# EasyEDA Pro project SBMS.eprj

# Schematic PowerSupply
Create Date: 2024-10-21; Page Name: P1; Project Name: SBMS; Schematic Name: PowerSupply; Update Date: 2024-10-21; Company: EasyEDA.com; Drawn: Edwin Mwiti; Page Size: A4; Part Number: JLCPCB-002; Version: V0.1
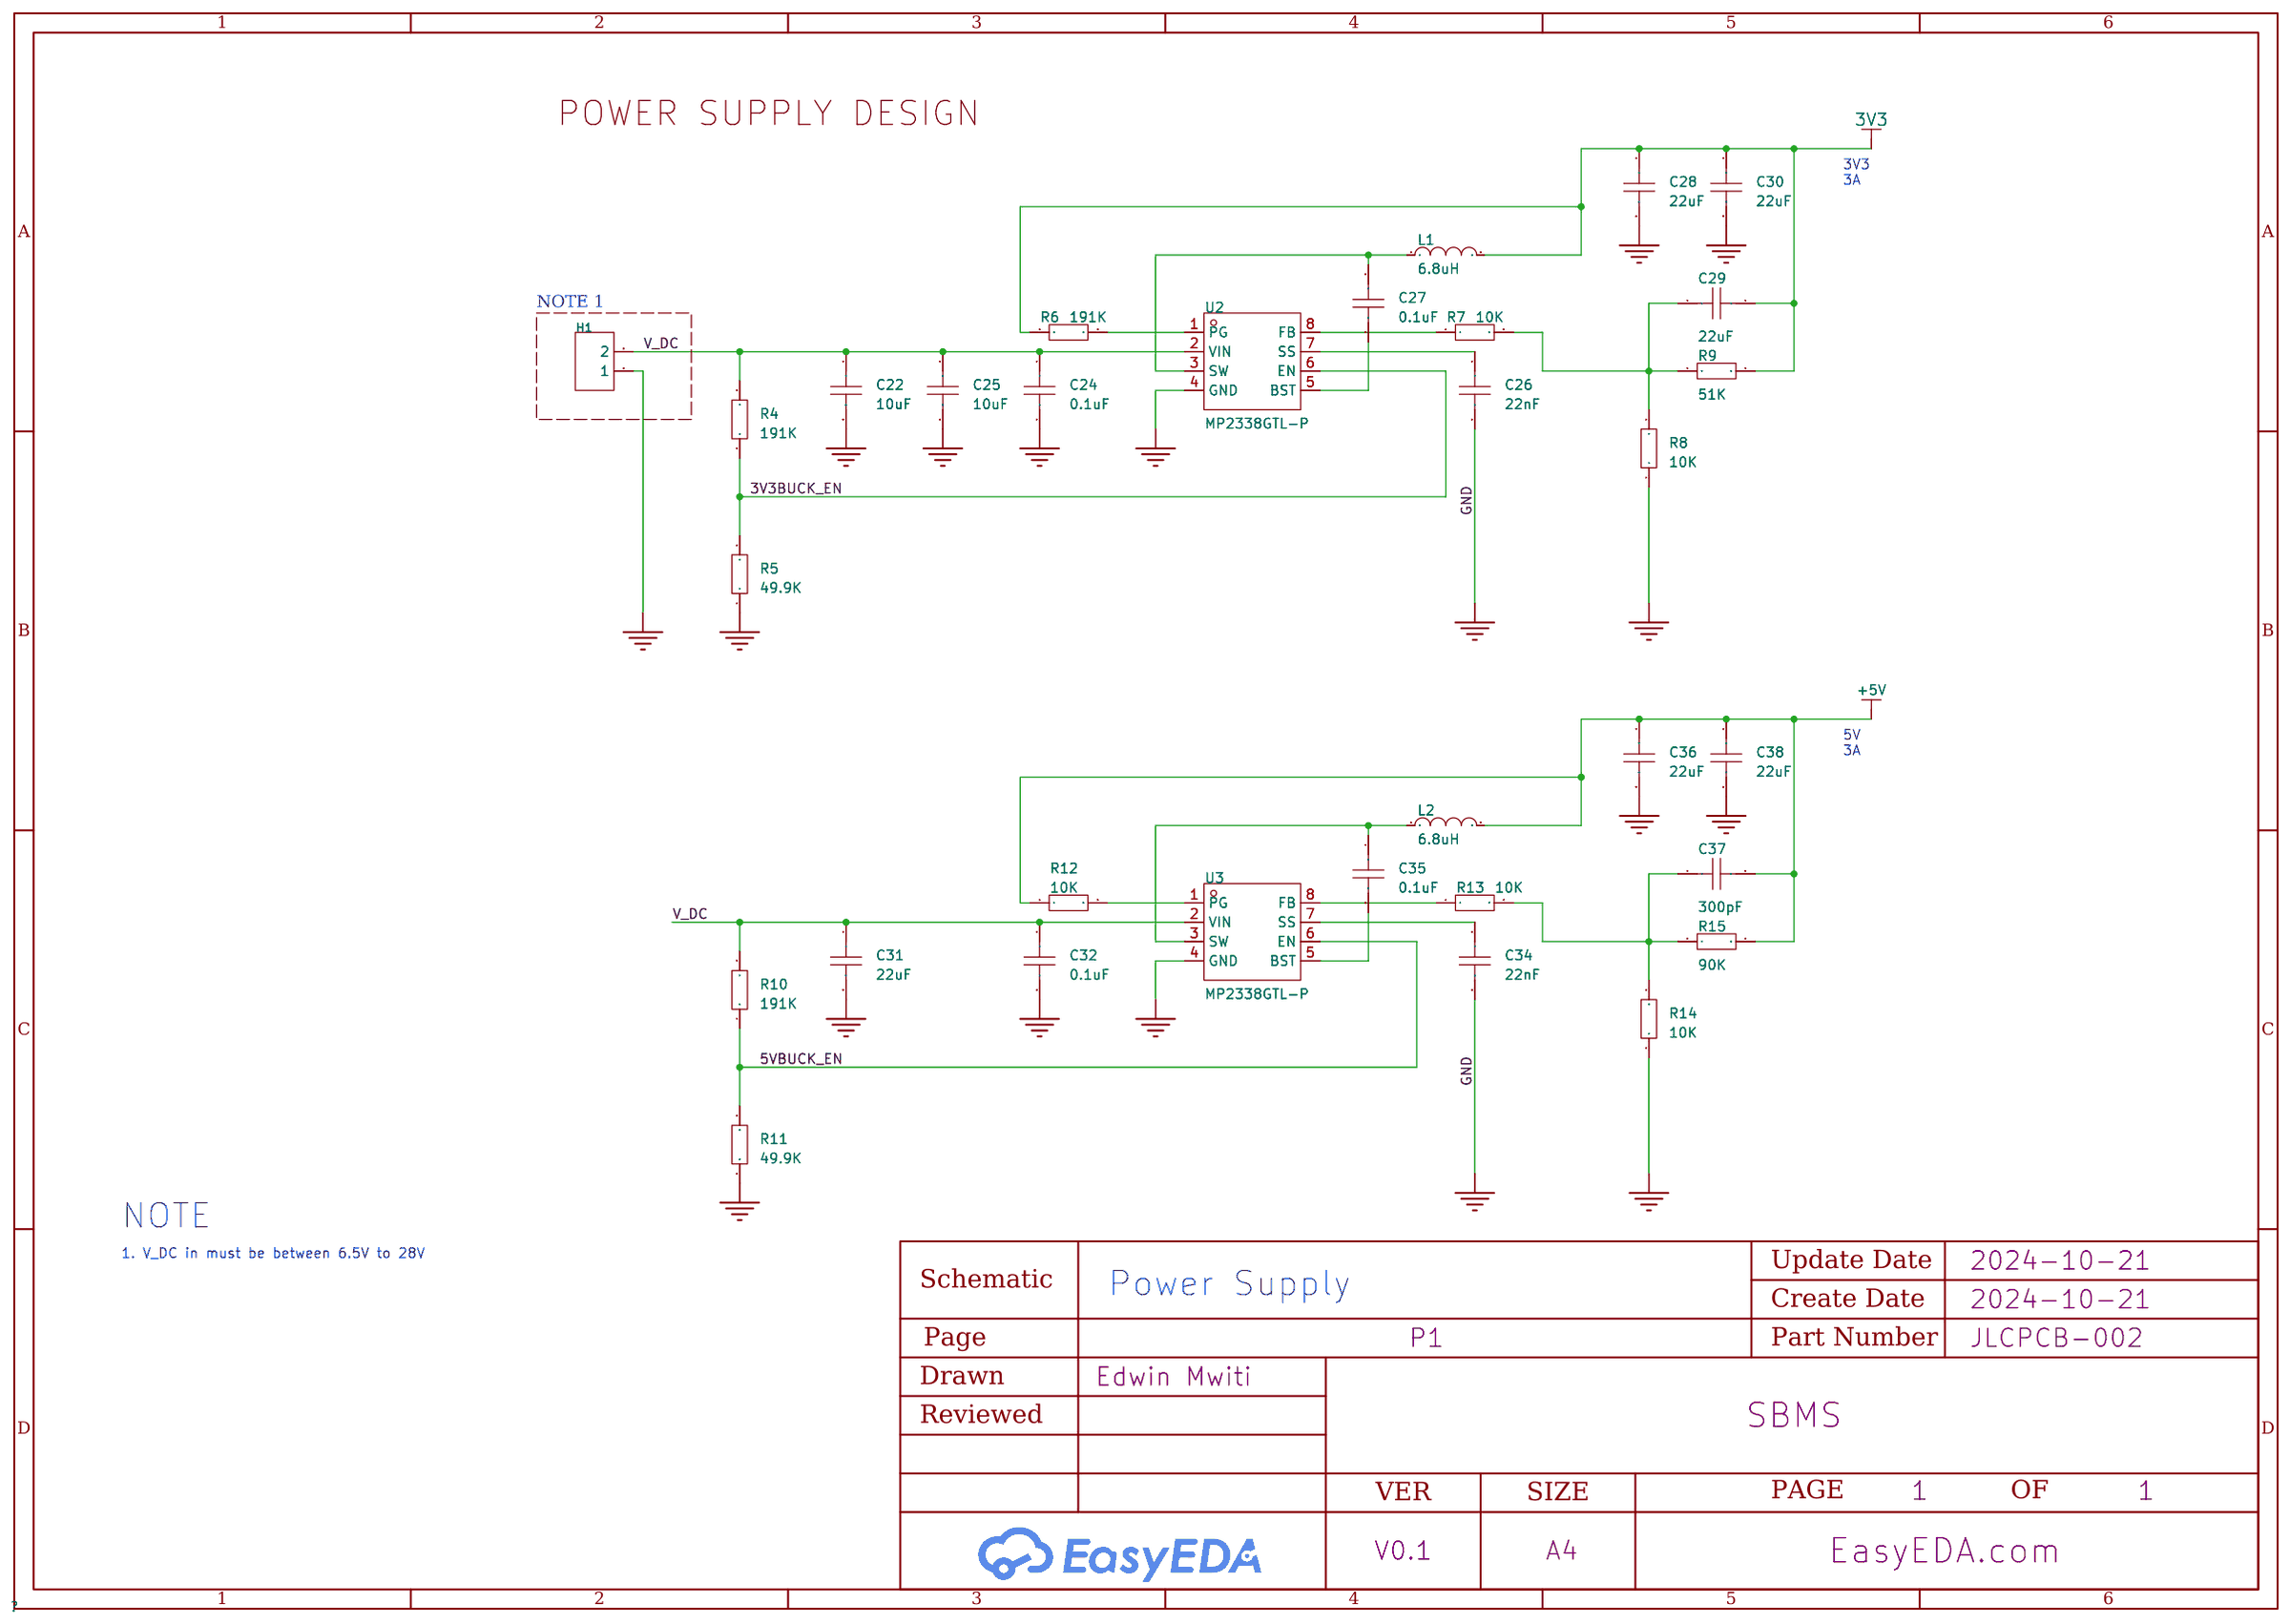
[diagram p0: schematic sheet]

## Parts
C22  10uF  [C0603]
C24  0.1uF  [C0402]
C25  10uF  [C0603]
C26  22nF  [C0402]
C27  0.1uF  [C0402]
C28  22uF  [C0603]
C29  22uF  [C0603]
C30  22uF  [C0603]
C31  22uF  [C0603]
C32  0.1uF  [C0402]
C34  22nF  [C0402]
C35  0.1uF  [C0402]
C36  22uF  [C0603]
C37  300pF  [C0603]
C38  22uF  [C0603]
H1  -  [HDR-TH_2P-P2.54-V-F]
L1  6.8uH  [IND-SMD_L7.2-W6.6_MS0640]
L2  6.8uH  [IND-SMD_L7.2-W6.6_MS0640]
R4  191K  [R0603]
R5  49.9K  [R0603]
R6  191K  [R0603]
R7  10K  [R0603]
R8  10K  [R0603]
R9  51K  [R0603]
R10  191K  [R0603]
R11  49.9K  [R0603]
R12  10K  [R0603]
R13  10K  [R0603]
R14  10K  [R0603]
R15  90K  [R0603]
U2  MP2338GTL-P  [SOT-583-8_L2.1-W1.2-P0.50-LS1.6-BR]
U3  MP2338GTL-P  [SOT-583-8_L2.1-W1.2-P0.50-LS1.6-BR]

## Library data of the parts
C22 C25 C28-C31 C36-C38 = CAP_0603: Supplier Footprint: 0603
C24 C26 C27 C32 C34 C35 = CAP_0402: Supplier Part: C1525; Supplier Footprint: 0402
H1 = HDR-F_2.54_1x2P: Supplier Footprint: Through
L1 L2 = CYA0620-6.8UH: Inductance: Tolerance:±20% Tolerance:±20% Rated Current: DC Resistance (DCR):; LCSC Part Name: 6.8uH ±20%; Supplier Part: C19274374; Manufacturer: SHOU HAN(首韩); Supplier Footprint: SMD,7.2x6.6mm; JLCPCB Part Class: Extended Part; Datasheet: https://atta.szlcsc.com/upload/public/pdf/source/20231201/72E84A4074F58B63B7744DFF20AA1B6D.pdf; Supplier: LCSC; Tolerance: ±20%
R4-R15 = Res_0603: Supplier Footprint: 0603
U2 U3 = MP2338GTL-P: Function:Step-down type Output Type:Adjustable Input Voltage:4.5V~28V Input Voltage:4.5V~28V Output Voltage:500mV~16V Output Voltage:500mV~16V Output Current:3A Switching Frequency:450kHz Switching Frequency:450kHz Operating Temperature:-40℃~+125℃@(TJ) Op; Supplier Part: C6595504; Manufacturer: MPS(芯源); Supplier Footprint: SOT-583; JLCPCB Part Class: Extended Part; Datasheet: https://atta.szlcsc.com/upload/public/pdf/source/20240130/5965F520C6AED27ECB92B94C3487A24C.pdf; Supplier: LCSC; Function: Step-down type; Output Type: Adjustable; Input Voltage: 4.5V~28V; Output Voltage: 500mV~16V; Output Current: 3A; Switching Frequency: 450kHz; Operating Temperature: -40℃~+125℃@(TJ); Synchronous Rectification: Yes; Number of Outputs: 1; Topology: Step-down; Switch tube (built-in/external): Built-in

## Nets
3V3: C28.1 C29.2 C30.1 L1.2 R6.1 R9.1
3V3BUCK_EN: R4.1 R5.2 U2.6(EN)
5VBUCK_EN: R10.1 R11.2 U3.6(EN)
+5V: C36.1 C37.2 C38.1 L2.2 R12.1 R15.1
GND: C22.2 C24.2 C25.2 C26.2 C28.2 C30.2 C31.2 C32.2 C34.2 C36.2 C38.2 H1.1 R5.1 R8.1 R11.1 R14.1 U2.4(GND) U3.4(GND)
V_DC: C22.1 C24.1 C25.1 C31.1 C32.1 H1.2 R4.2 R10.2 U2.2(VIN) U3.2(VIN)
Net-(C26-1): C26.1 U2.7(SS)
Net-(C27-1): C27.1 L1.1 U2.3(SW)
Net-(C27-2): C27.2 U2.5(BST)
Net-(C29-1): C29.1 R7.2 R8.2 R9.2
Net-(C34-1): C34.1 U3.7(SS)
Net-(C35-1): C35.1 L2.1 U3.3(SW)
Net-(C35-2): C35.2 U3.5(BST)
Net-(C37-1): C37.1 R13.2 R14.2 R15.2
Net-(R6-2): R6.2 U2.1(PG)
Net-(R7-1): R7.1 U2.8(FB)
Net-(R12-2): R12.2 U3.1(PG)
Net-(R13-1): R13.1 U3.8(FB)

## Notes on the sheet
- POWER SUPPLY DESIGN
- 3V3
  3A
- NOTE 1
- 5V
  3A
- NOTE
- 1. V_DC in must be between 6.5V to 28V
- Power Supply

# Schematic STM32F429ZET6MCU
Create Date: 2024-10-21; Page Name: P1; Project Name: SBMS; Schematic Name: STM32F429ZET6MCU; Update Date: 2024-10-21; Company: EasyEDA.com; Drawn: Edwin Mwiti; Page Size: A4; Part Number: JLCPCB-002; Reviewed: EasyEDA; Version: V0.1
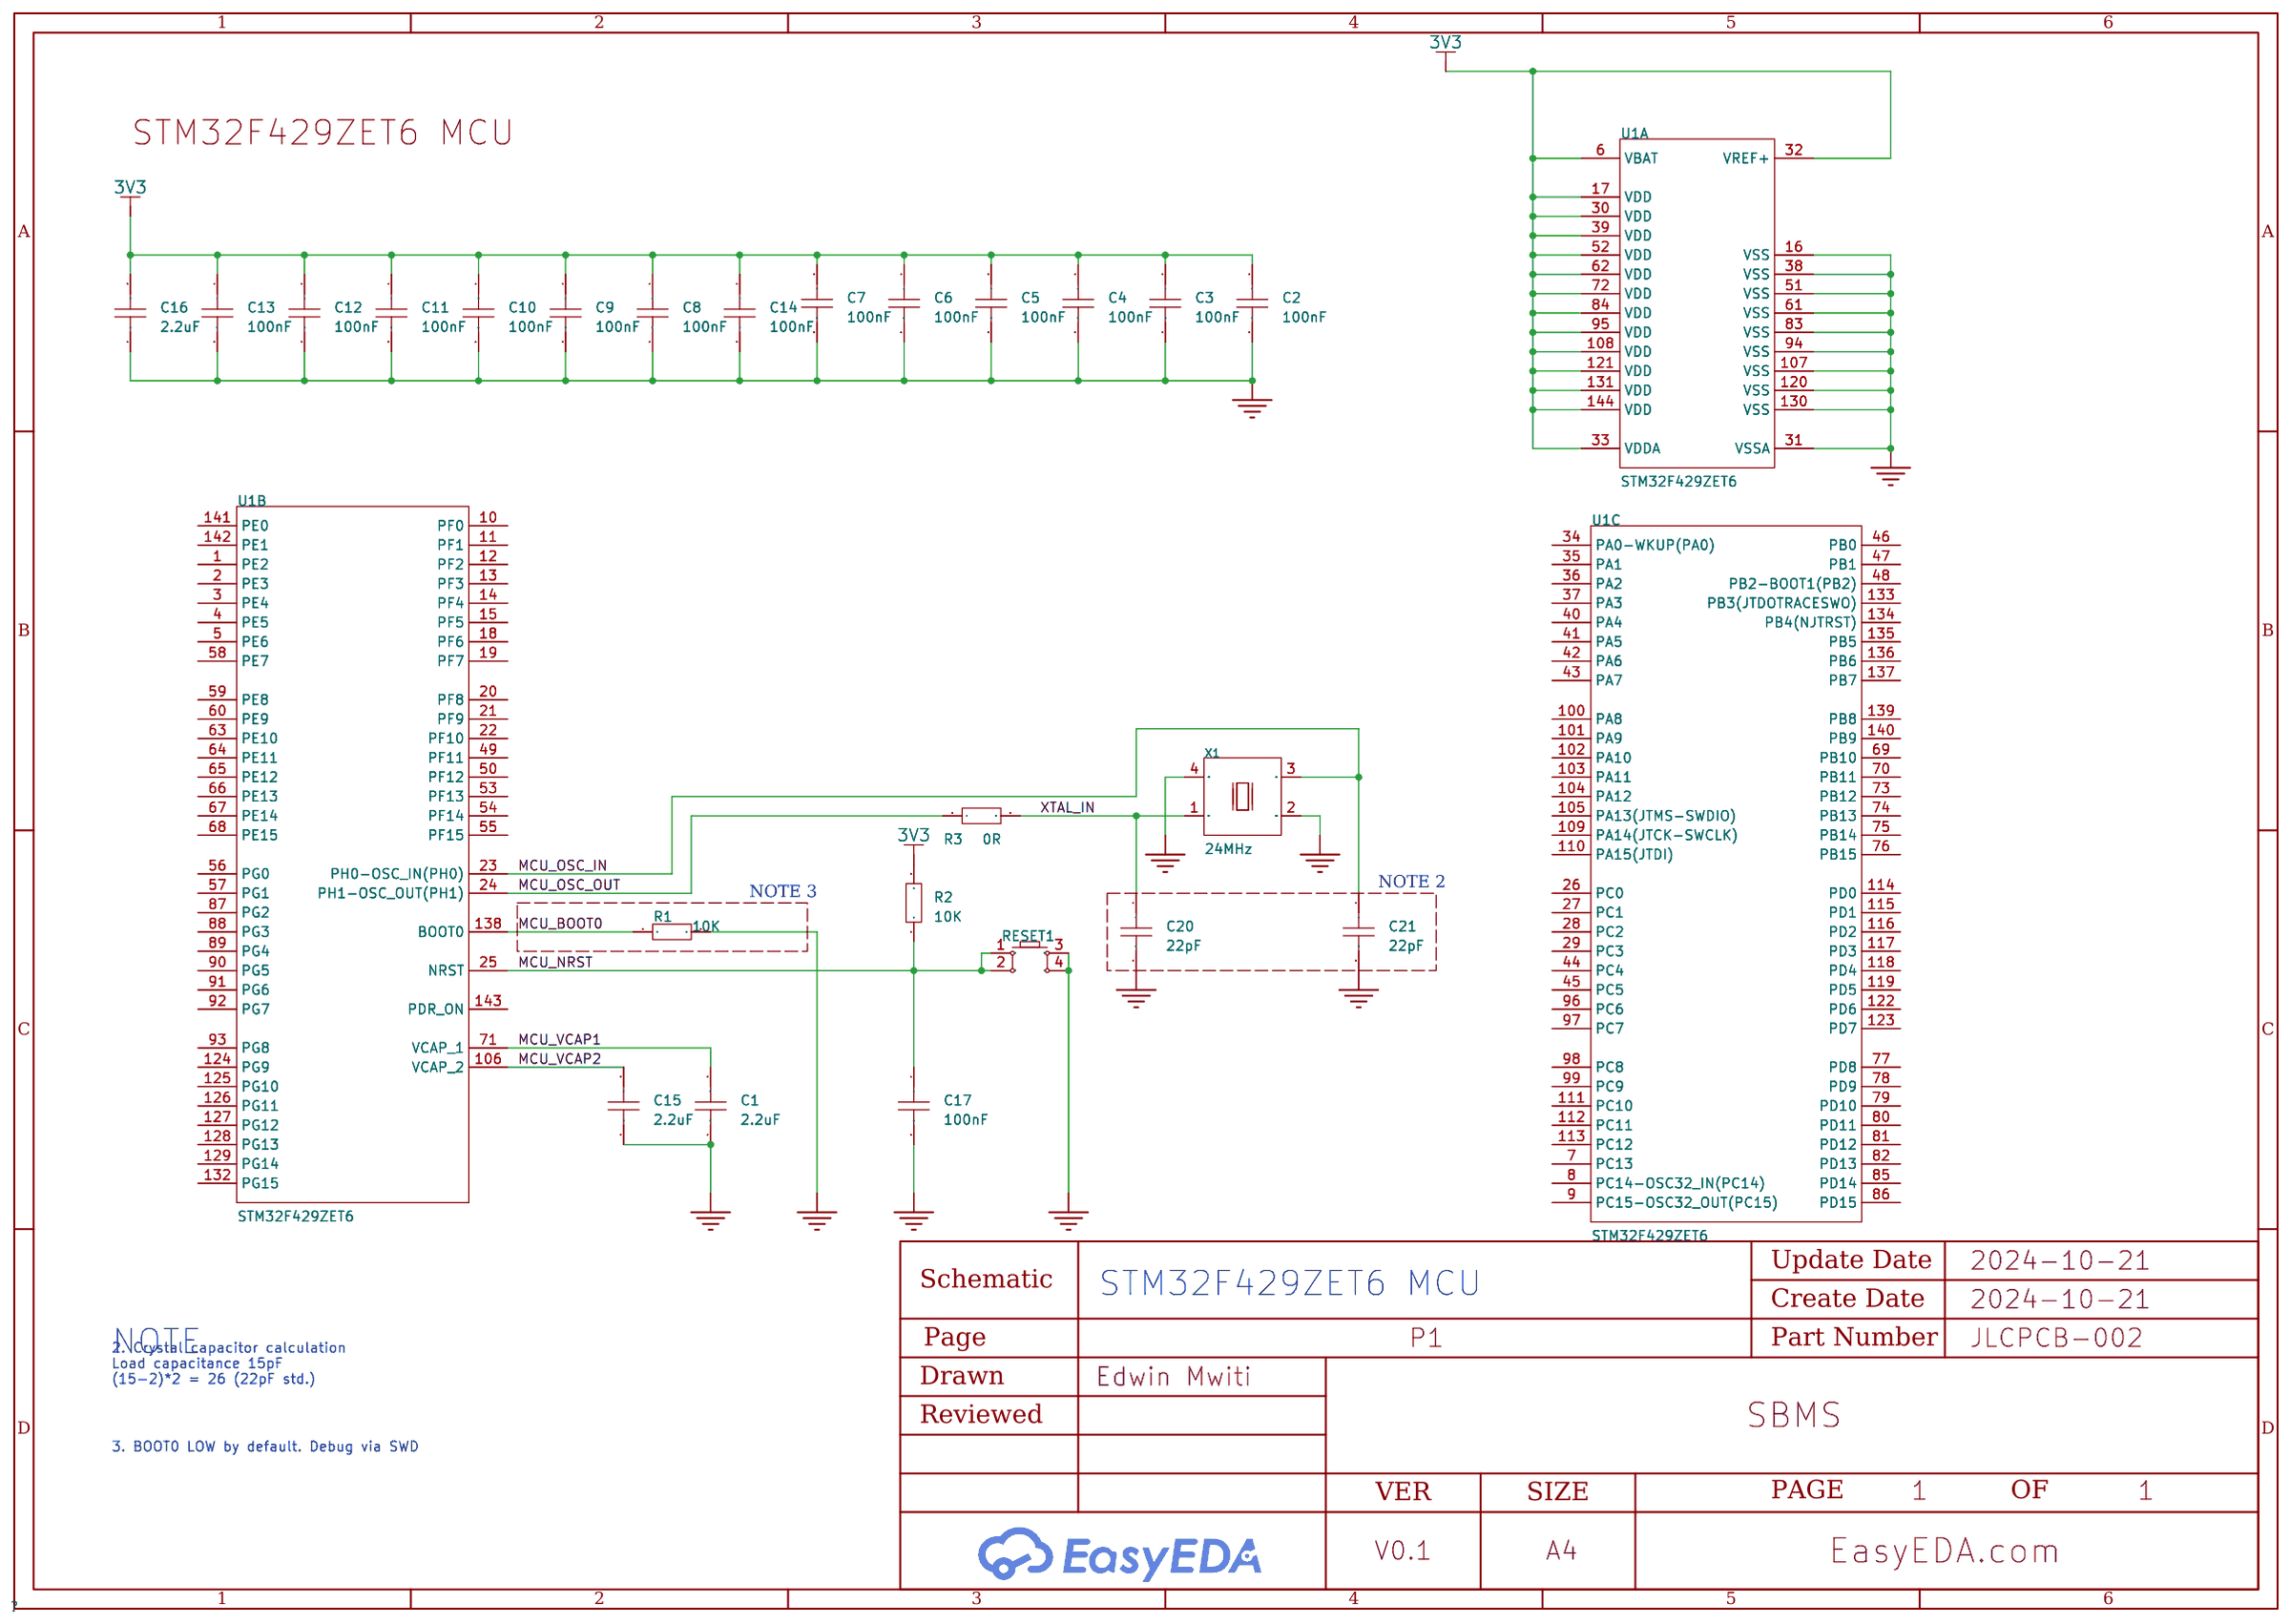
[diagram p1: schematic sheet]

## Parts
C1  2.2uF  [C0603]
C2  100nF  [C0201]
C3  100nF  [C0201]
C4  100nF  [C0201]
C5  100nF  [C0201]
C6  100nF  [C0201]
C7  100nF  [C0201]
C8  100nF  [C0201]
C9  100nF  [C0201]
C10  100nF  [C0201]
C11  100nF  [C0201]
C12  100nF  [C0201]
C13  100nF  [C0201]
C14  100nF  [C0201]
C15  2.2uF  [C0603]
C16  2.2uF  [C0603]
C17  100nF  [C0201]
C20  22pF  [C0402]
C21  22pF  [C0402]
R1  10K  [R0402]
R2  10K  [R0402]
R3  0R  [R0402]
RESET1  -  [SW-SMD_4P-L6.0-W6.0-P4.50-LS9.0-2]
U1  STM32F429ZET6  [LQFP-144_L20.0-W20.0-P0.50-LS22.0-BL]  (sections 1,2,3)
X1  24MHz  [OSC-SMD_4P-L5.0-W3.2-BL_SG5032]

## Library data of the parts
C1 C15 C16 = C0603X7R225K160NT: Capacitance: Voltage Rated: Temperature Coefficient:; LCSC Part Name: 2.2uF 16V; Supplier Part: C2835569; Manufacturer: SANYEAR(叁叶源); Supplier Footprint: 0603; JLCPCB Part Class: Extended Part; Datasheet: https://atta.szlcsc.com/upload/public/pdf/source/20211010/C2835569_9DE266D9A99116FA35738971B2E667B7.pdf; Supplier: LCSC
C2-C14 C17 = CAP_0201: Supplier Footprint: 0201
C20 C21 = CAP_0402: Supplier Part: C1525; Supplier Footprint: 0402
R1-R3 = Res_0402: Supplier Footprint: 0402
RESET1 = Key_SMD_6x6x6.5: Supplier Footprint: SMD
U1 = STM32F429ZET6: CPU Core:ARM-M4 Program Storage Size:512KB RAM Size:256KB GPIO Ports Number:114 Operating Voltage Range:1.8V~3.6V Operating Voltage Range:1.8V~3.6V CPU Maximum Speed:180MHz Program Memory Type:FLASH Operating Temperature Range:-40℃~+85℃ Operating Temperat; LCSC Part Name: 带DSP和FPU的高性能高级系列ARM Cortex-M4 MCU，具有512 KB Flash、180 MHz CPU、ART加速器、Chrom-ART加速器、TFT、带SDRAM的FMC和TFT; Supplier Part: C84456; Manufacturer: ST(意法半导体); Supplier Footprint: LQFP-144(20x20); JLCPCB Part Class: Extended Part; Datasheet: https://atta.szlcsc.com/upload/public/pdf/source/20170304/1488621179047.pdf; Supplier: LCSC; CPU Core: ARM-M4; Program Storage Size: 512KB; RAM Size: 256KB; GPIO Ports Number: 114; Operating Voltage Range: 1.8V~3.6V; CPU Maximum Speed: 180MHz; Program Memory Type: FLASH; Operating Temperature Range: -40℃~+85℃; ADC (Bit): 12bit; DAC (Bit): 12bit; Universal Serial Bus: Yes; Peripheral/Function: DMA；LCD/LED Driver; Watchdog: Yes; Infrared Data Association: Yes; Low-Voltage Detect: Yes; LCD Module: Yes; Direct Memory Access: Yes; Internal Oscillator: Yes
X1 = OVETGLJANF-24MHZ: Frequency:24MHz Supply Voltage:3.3V Supply Voltage:3.3V Supply Current (Max):10mA Frequency Stability(Full temperature range):±50ppm Frequency Stability(Full temperature range):±50ppm Operating Temperature:-40℃~+85℃ Operating Temperature:-40℃~+85℃; Supplier Part: C295512; Manufacturer: TAITIEN(泰艺电子); Supplier Footprint: SMD5032-4P; JLCPCB Part Class: Extended Part; Datasheet: https://atta.szlcsc.com/upload/public/pdf/source/20180928/C295520_48B356F7809173AC11594D18D95FC95F.pdf; Supplier: LCSC; Supply Voltage: 3.3V; Supply Current (Max): 10mA; Frequency Stability(Full temperature range): ±50ppm; Operating Temperature: -40℃~+85℃

## Nets
3V3: C2.1 C3.1 C4.1 C5.1 C6.1 C7.1 C8.1 C9.1 C10.1 C11.1 C12.1 C13.1 C14.1 C16.2 R2.2 U1.6(VBAT) U1.17(VDD) U1.30(VDD) U1.32(VREF+) U1.33(VDDA) U1.39(VDD) U1.52(VDD) U1.62(VDD) U1.72(VDD) U1.84(VDD) U1.95(VDD) U1.108(VDD) U1.121(VDD) U1.131(VDD) U1.144(VDD)
GND: C1.1 C2.2 C3.2 C4.2 C5.2 C6.2 C7.2 C8.2 C9.2 C10.2 C11.2 C12.2 C13.2 C14.2 C15.1 C16.1 C17.2 C20.2 C21.2 R1.2 RESET1.3 RESET1.4 U1.16(VSS) U1.31(VSSA) U1.38(VSS) U1.51(VSS) U1.61(VSS) U1.83(VSS) U1.94(VSS) U1.107(VSS) U1.120(VSS) U1.130(VSS) X1.2(GND) X1.4(VCC)
MCU_BOOT0: R1.1 U1.138(BOOT0)
MCU_NRST: C17.1 R2.1 RESET1.1 RESET1.2 U1.25(NRST)
MCU_OSC_IN: C21.1 U1.23(PH0-OSC_IN(PH0)) X1.3(OUT)
MCU_OSC_OUT: R3.1 U1.24(PH1-OSC_OUT(PH1))
MCU_VCAP1: C1.2 U1.71(VCAP_1)
MCU_VCAP2: C15.2 U1.106(VCAP_2)
XTAL_IN: C20.1 R3.2 X1.1(tri)

Not connected (* = marked no-connect by the designer): U1 1(PE2) 2(PE3) 3(PE4) 4(PE5) 5(PE6) 7(PC13) 8(PC14-OSC32_IN(PC14)) 9(PC15-OSC32_OUT(PC15)) 10(PF0) 11(PF1) 12(PF2) 13(PF3) 14(PF4) 15(PF5) 18(PF6) 19(PF7) 20(PF8) 21(PF9) 22(PF10) 26(PC0) 27(PC1) 28(PC2) 29(PC3) 34(PA0-WKUP(PA0)) 35(PA1) 36(PA2) 37(PA3) 40(PA4) 41(PA5) 42(PA6) 43(PA7) 44(PC4) 45(PC5) 46(PB0) 47(PB1) 48(PB2-BOOT1(PB2)) 49(PF11) 50(PF12) 53(PF13) 54(PF14) 55(PF15) 56(PG0) 57(PG1) 58(PE7) 59(PE8) 60(PE9) 63(PE10) 64(PE11) 65(PE12) 66(PE13) 67(PE14) 68(PE15) 69(PB10) 70(PB11) 73(PB12) 74(PB13) 75(PB14) 76(PB15) 77(PD8) 78(PD9) 79(PD10) 80(PD11) 81(PD12) 82(PD13) 85(PD14) 86(PD15) 87(PG2) 88(PG3) 89(PG4) 90(PG5) 91(PG6) 92(PG7) 93(PG8) 96(PC6) 97(PC7) 98(PC8) 99(PC9) 100(PA8) 101(PA9) 102(PA10) 103(PA11) 104(PA12) 105(PA13(JTMS-SWDIO)) 109(PA14(JTCK-SWCLK)) 110(PA15(JTDI)) 111(PC10) 112(PC11) 113(PC12) 114(PD0) 115(PD1) 116(PD2) 117(PD3) 118(PD4) 119(PD5) 122(PD6) 123(PD7) 124(PG9) 125(PG10) 126(PG11) 127(PG12) 128(PG13) 129(PG14) 132(PG15) 133(PB3(JTDOTRACESWO)) 134(PB4(NJTRST)) 135(PB5) 136(PB6) 137(PB7) 139(PB8) 140(PB9) 141(PE0) 142(PE1) 143(PDR_ON)

## Notes on the sheet
- STM32F429ZET6 MCU
- NOTE 3
- NOTE 2
- STM32F429ZET6 MCU
- NOTE
- 2. Crystal capacitor calculation
  Load capacitance 15pF
  (15-2)*2 = 26 (22pF std.)
- 3. BOOT0 LOW by default. Debug via SWD

# Schematic GSM/LTE
Create Date: 2024-10-21; Page Name: P1; Project Name: SBMS; Schematic Name: GSM/LTE; Update Date: 2024-10-21; Company: EasyEDA.com; Drawn: EasyEDA; Page Size: A4; Part Number: JLCPCB-002; Reviewed: EasyEDA; Version: V0.1
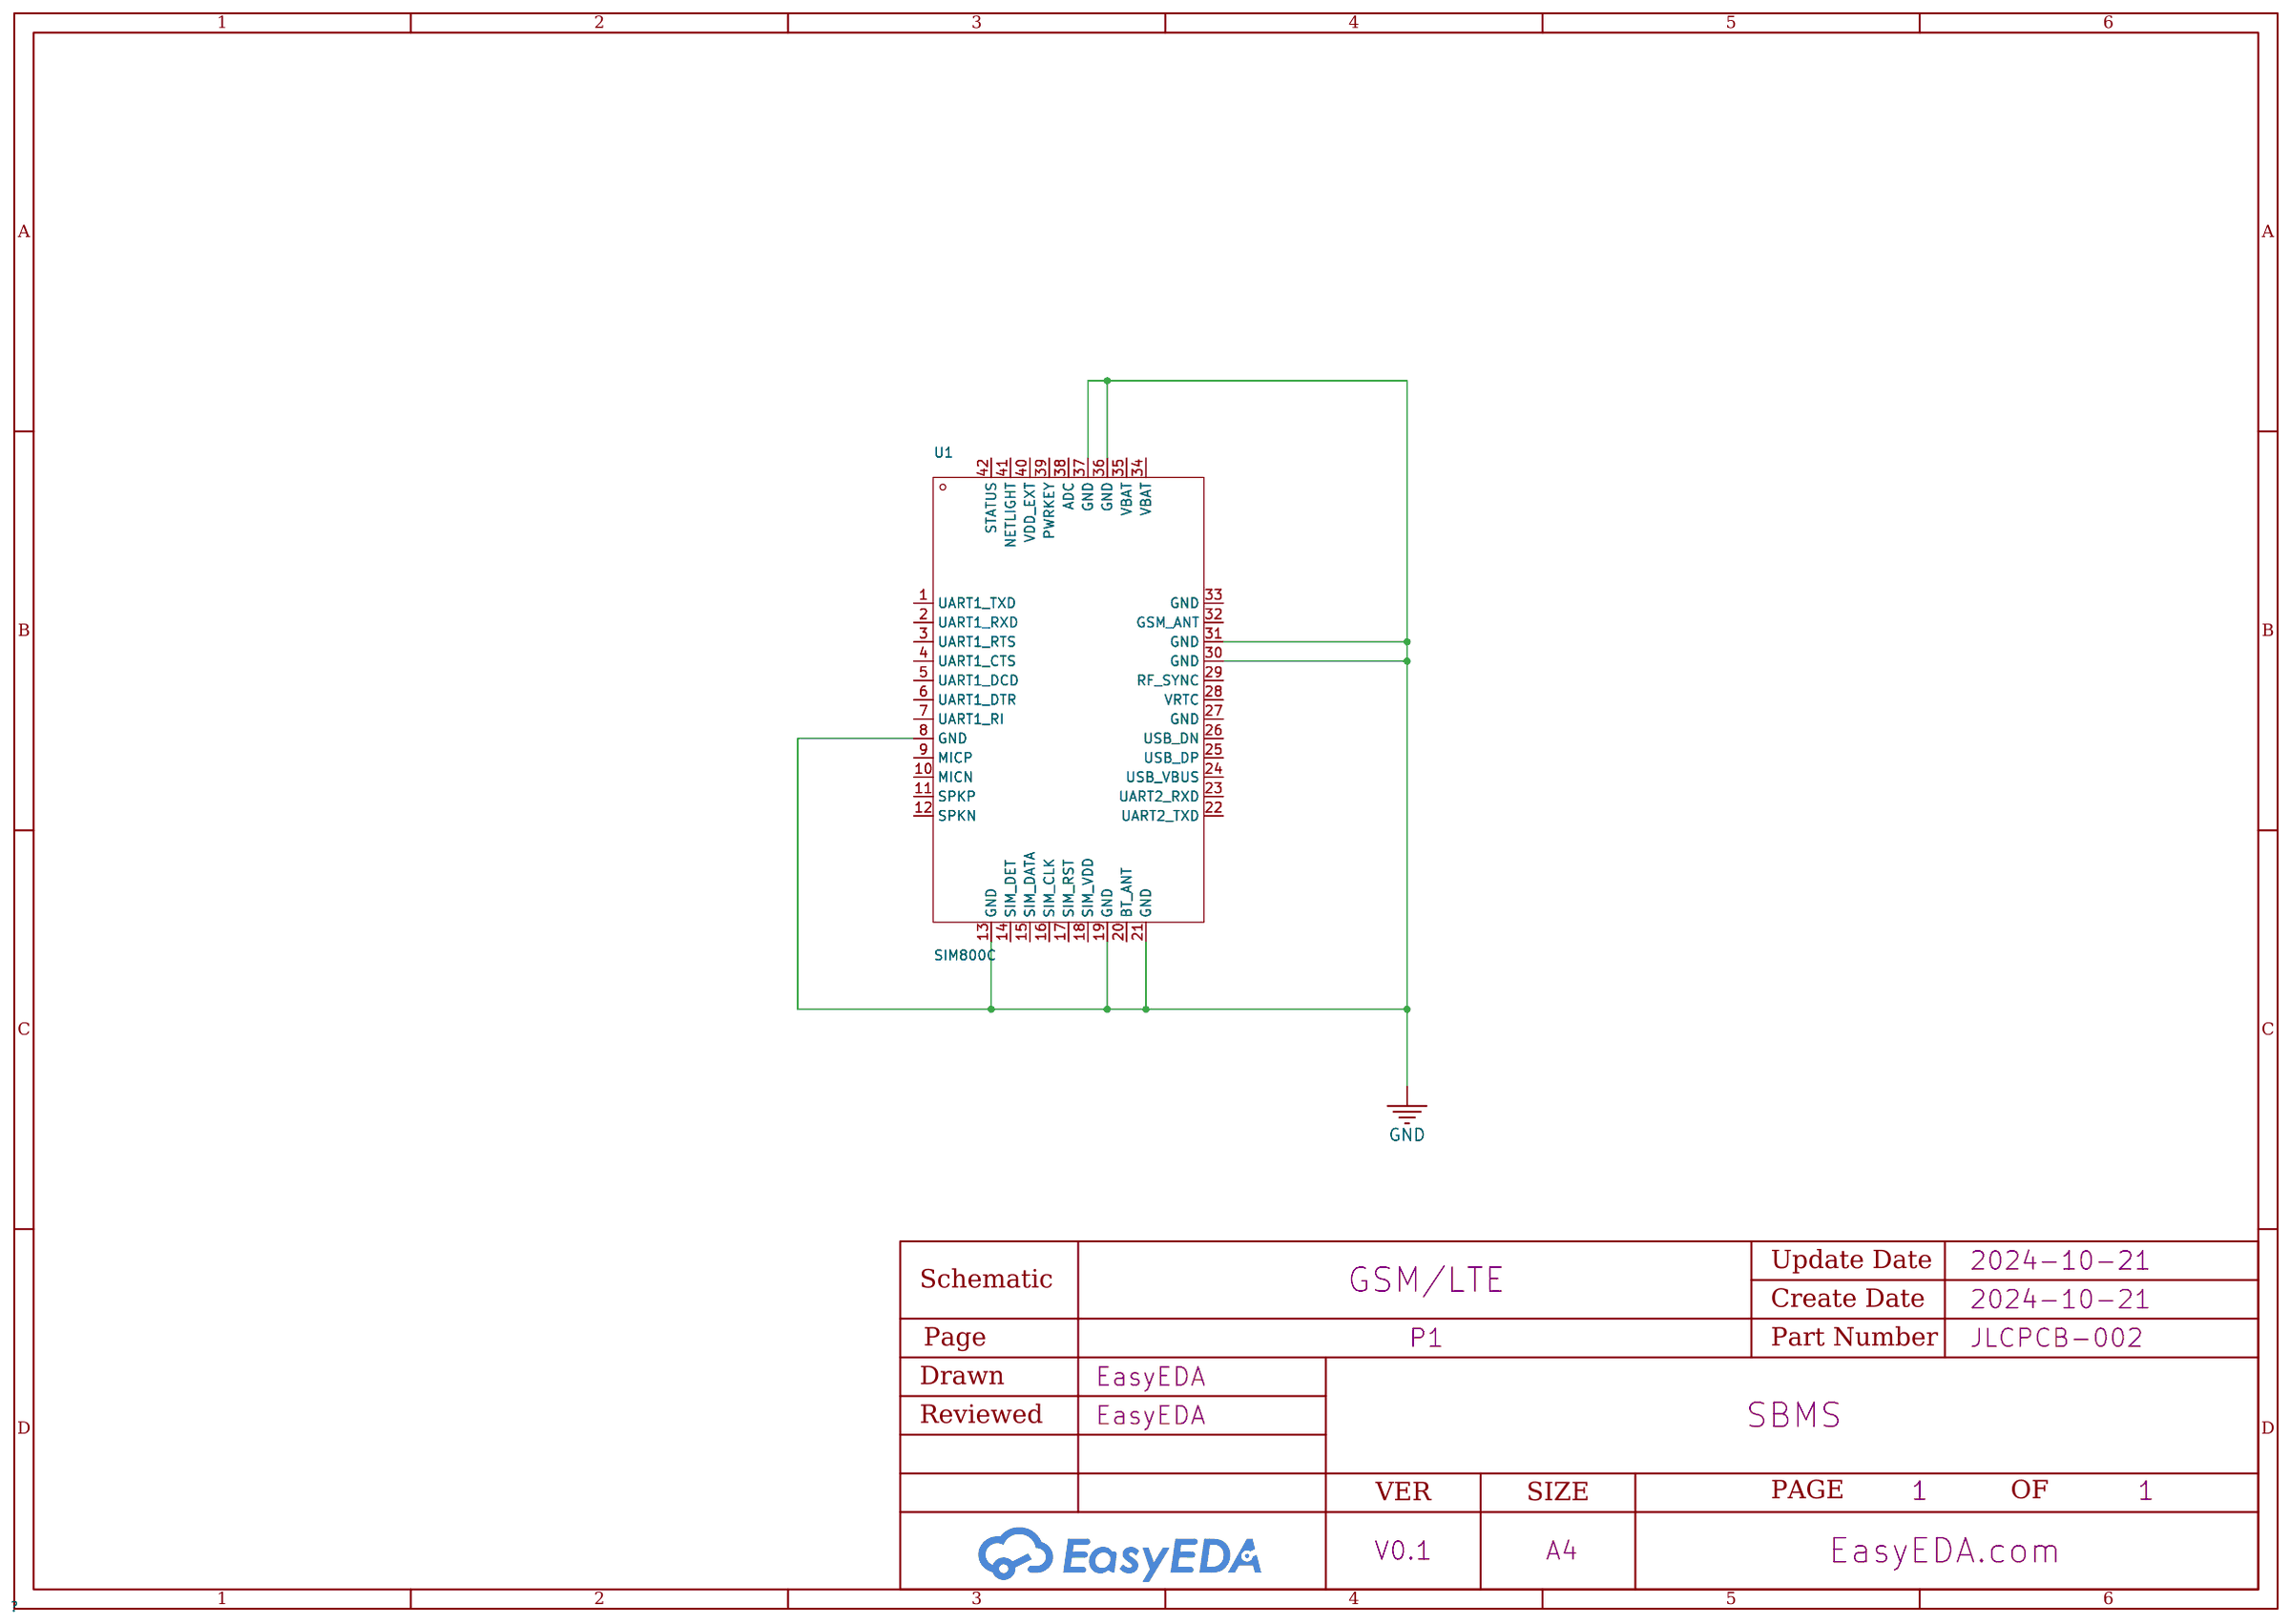
[diagram p2: schematic sheet]

## Parts
U1  SIM800C  [GSM-SMD_42P-L17.6-W15.7-P1.10-TL]

## Library data of the parts
U1 = SIM800C_C2981431: Supplier Part: C2981431; Manufacturer: SIMCOM(芯讯通无线科技); Supplier Footprint: SMD,15.7x17.6mm; JLCPCB Part Class: Extended Part; Datasheet: https://atta.szlcsc.com/upload/public/pdf/source/20220321/598764F20298B535F46C8952C06A03E6.pdf; Supplier: LCSC

## Nets
GND: U1.8(GND) U1.13(GND) U1.19(GND) U1.21(GND) U1.30(GND) U1.31(GND) U1.36(GND) U1.37(GND)

Not connected (* = marked no-connect by the designer): U1 1(UART1_TXD) 2(UART1_RXD) 3(UART1_RTS) 4(UART1_CTS) 5(UART1_DCD) 6(UART1_DTR) 7(UART1_RI) 9(MICP) 10(MICN) 11(SPKP) 12(SPKN) 14(SIM_DET) 15(SIM_DATA) 16(SIM_CLK) 17(SIM_RST) 18(SIM_VDD) 20(BT_ANT) 22(UART2_TXD) 23(UART2_RXD) 24(USB_VBUS) 25(USB_DP) 26(USB_DN) 27(GND) 28(VRTC) 29(RF_SYNC) 32(GSM_ANT) 33(GND) 34(VBAT) 35(VBAT) 38(ADC) 39(PWRKEY) 40(VDD_EXT) 41(NETLIGHT) 42(STATUS)

# Schematic I2C_CAN_R485
Create Date: 2024-10-21; Page Name: P1; Project Name: SBMS; Schematic Name: I2C_CAN_R485; Update Date: 2024-10-21; Company: EasyEDA.com; Drawn: Edwin Mwiti; Page Size: A4; Part Number: JLCPCB-002; Version: V0.1
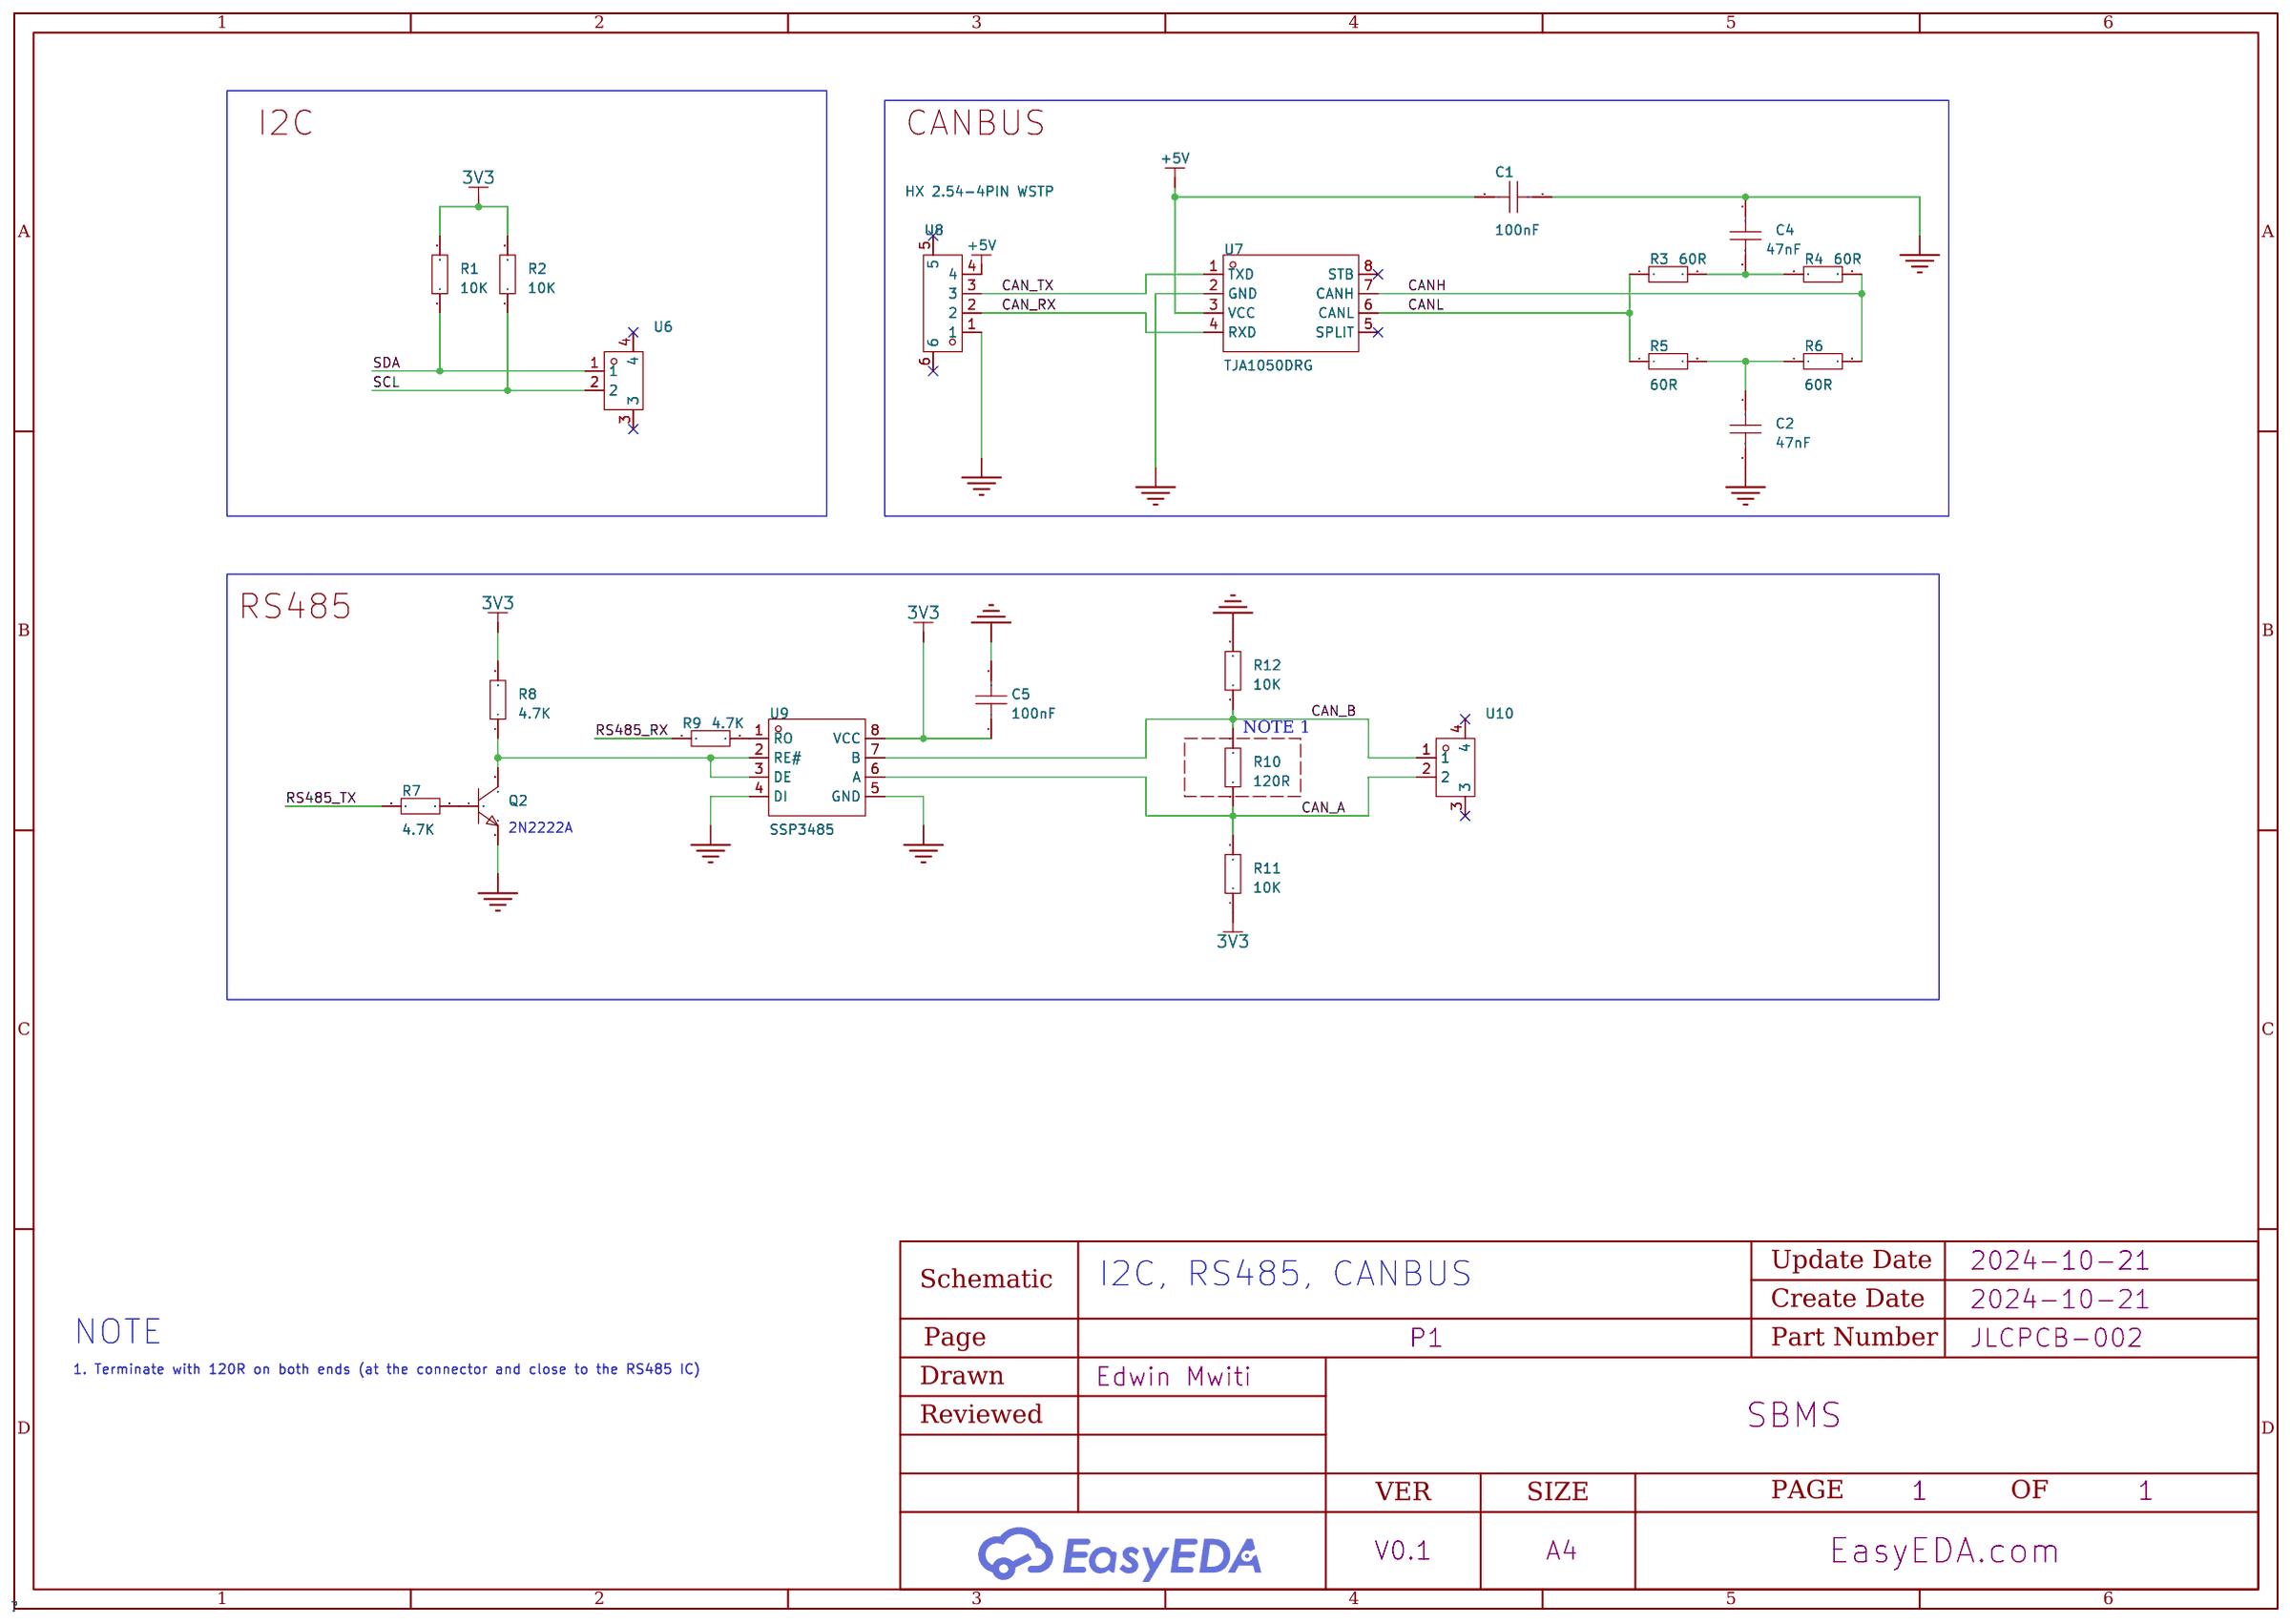
[diagram p3: schematic sheet]

## Parts
C1  100nF  [C0402]
C2  47nF  [C0402]
C4  47nF  [C0402]
C5  100nF  [C0402]
Q2  -  [SOT-23_L2.9-W1.3-P1.90-LS2.4-BR]
R1  10K  [R0402]
R2  10K  [R0402]
R3  60R  [R0402]
R4  60R  [R0402]
R5  60R  [R0402]
R6  60R  [R0402]
R7  4.7K  [R0402]
R8  4.7K  [R0402]
R9  4.7K  [R0402]
R10  120R  [R0402]
R11  10K  [R0402]
R12  10K  [R0402]
U6  HX 2.54-2PIN LTJS  [CONN-SMD_2P-P2.54_HX-2.54-2PIN-LTJS]
U7  TJA1050DRG  [SOP-8_L4.9-W3.9-P1.27-LS6.0-BL]
U8  HX 2.54-4PIN WSTP  [CONN-SMD_4P-P2.50_HX-2.54-4PIN-WSTP]
U9  SSP3485  [SOP-8_L5.0-W3.9-P1.27-LS6.0-BL]
U10  HX 2.54-2PIN LTJS  [CONN-SMD_2P-P2.54_HX-2.54-2PIN-LTJS]

## Library data of the parts
C1 C2 C4 C5 = CAP_0402: Supplier Part: C1525; Supplier Footprint: 0402
Q2 = S8050_NPN: Supplier Footprint: SOT-23
R1-R12 = Res_0402: Supplier Footprint: 0402
U6 U10 = HX 2.54-2PIN LTJS: Pins Structure:1x2P Pitch:2.5mm Mounting Style:Standing paste Number of Pins:2P Number of Rows:1 Number of PINs Per Row:2 Current Rating (Max):3A Operating Temperature Range:-25℃~+85℃ Operating Temperature Range:-25℃~+85℃; Supplier Part: C19270024; Manufacturer: hanxia(韩下); Supplier Footprint: SMD,P=2.5mm; JLCPCB Part Class: Extended Part; Datasheet: https://atta.szlcsc.com/upload/public/pdf/source/20231127/C171462207A07C6644D24011A39141BD.pdf; Supplier: LCSC; Pins Structure: 1x2P; Pitch: 2.5mm; Mounting Style: Standing paste; Number of Pins: 2P; Number of Rows: 1; Number of PINs Per Row: 2; Current Rating (Max): 3A; Operating Temperature Range: -25℃~+85℃
U7 = TJA1050DRG: Supplier Part: C19723770; Manufacturer: HGC(深圳汉芯); Supplier Footprint: SOP-8; JLCPCB Part Class: Extended Part; Datasheet: https://atta.szlcsc.com/upload/public/pdf/source/20231229/9EC40A6172CAB0350BF7AF3421F4DEBF.pdf; Supplier: LCSC
U8 = HX 2.54-4PIN WSTP: Pins Structure:1x4P Pitch:2.5mm Mounting Style:卧贴 Number of Pins:4P Number of Rows:1 Number of PINs Per Row:4 Current Rating (Max):3A Contact Material:Phosphor bronze Contact Plating:Tin Operating Temperature Range:-25℃~+85℃ Operating Temperature Range:-2; LCSC Part Name: 1x4P 间距:2.5mm 卧贴; Supplier Part: C19270031; Manufacturer: hanxia(韩下); Supplier Footprint: SMD,P=2.5mm,卧贴; JLCPCB Part Class: Extended Part; Datasheet: https://atta.szlcsc.com/upload/public/pdf/source/20231127/AE22B3CF6CD8C215287445117BEBD287.pdf; Supplier: LCSC; Pins Structure: 1x4P; Pitch: 2.5mm; Mounting Style: 卧贴; Number of Pins: 4P; Number of Rows: 1; Number of PINs Per Row: 4; Current Rating (Max): 3A; Contact Material: Phosphor bronze; Contact Plating: Tin; Operating Temperature Range: -25℃~+85℃
U9 = SSP3485: Types:transceiver Supply Voltage:5V Supply Voltage:5V Data Rate:10Mbps Data Rate:10Mbps Driver/receiver:1/1 Node Number:256 ESD Protect:±15kV ESD Protect:±15kV Operating Temperature:-40℃~+85℃ Operating Temperature:-40℃~+85℃; Supplier Part: C2845064; Manufacturer: Siproin(上海矽朋); Supplier Footprint: SOP-8; JLCPCB Part Class: Extended Part; Datasheet: https://atta.szlcsc.com/upload/public/pdf/source/20220525/9F5C0B43AE697F097D5572C2C622EA91.pdf; Supplier: LCSC; Types: transceiver; Supply Voltage: 5V; Data Rate: 10Mbps; Driver/receiver: 1/1; Node Number: 256; ESD Protect: ±15kV; Operating Temperature: -40℃~+85℃

## Nets
3V3: C5.1 R1.2 R2.2 R8.2 R11.1 U9.8(VCC)
+5V: C1.2 U7.3(VCC) U8.4
GND: C1.1 C2.2 C4.1 C5.2 Q2.2(E) R12.2 U7.2(GND) U8.1 U9.4(DI) U9.5(GND)
CAN_A: R10.1 R11.2 U9.6(A) U10.2
CAN_B: R10.2 R12.1 U9.7(B) U10.1
CAN_RX: U7.4(RXD) U8.2
CAN_TX: U7.1(TXD) U8.3
CANH: R4.2 R6.2 U7.7(CANH)
CANL: R3.1 R5.1 U7.6(CANL)
RS485_RX: R9.1
RS485_TX: R7.2
SCL: R2.1 U6.2
SDA: R1.1 U6.1
Net-(C2-1): C2.1 R5.2 R6.1
Net-(C4-2): C4.2 R3.2 R4.1
Net-(Q2-1): Q2.1(B) R7.1
Net-(Q2-3): Q2.3(C) R8.1 U9.2(RE#) U9.3(DE)
Net-(R9-2): R9.2 U9.1(RO)

Not connected (* = marked no-connect by the designer): U6 3* 4*; U7 5(SPLIT)* 8(STB)*; U8 5* 6*; U10 3* 4*

## Notes on the sheet
- I2C
- CANBUS
- RS485
- NOTE 1
- 2N2222A
- I2C, RS485, CANBUS
- NOTE
- 1. Terminate with 120R on both ends (at the connector and close to the RS485 IC)

# Schematic UserButtonLED
Create Date: 2024-10-21; Page Name: P1; Project Name: SBMS; Schematic Name: Schematic1; Update Date: 2024-10-21; Company: EasyEDA.com; Drawn: Edwin Mwiti; Page Size: A4; Part Number: JLCPCB-002; Version: V0.1
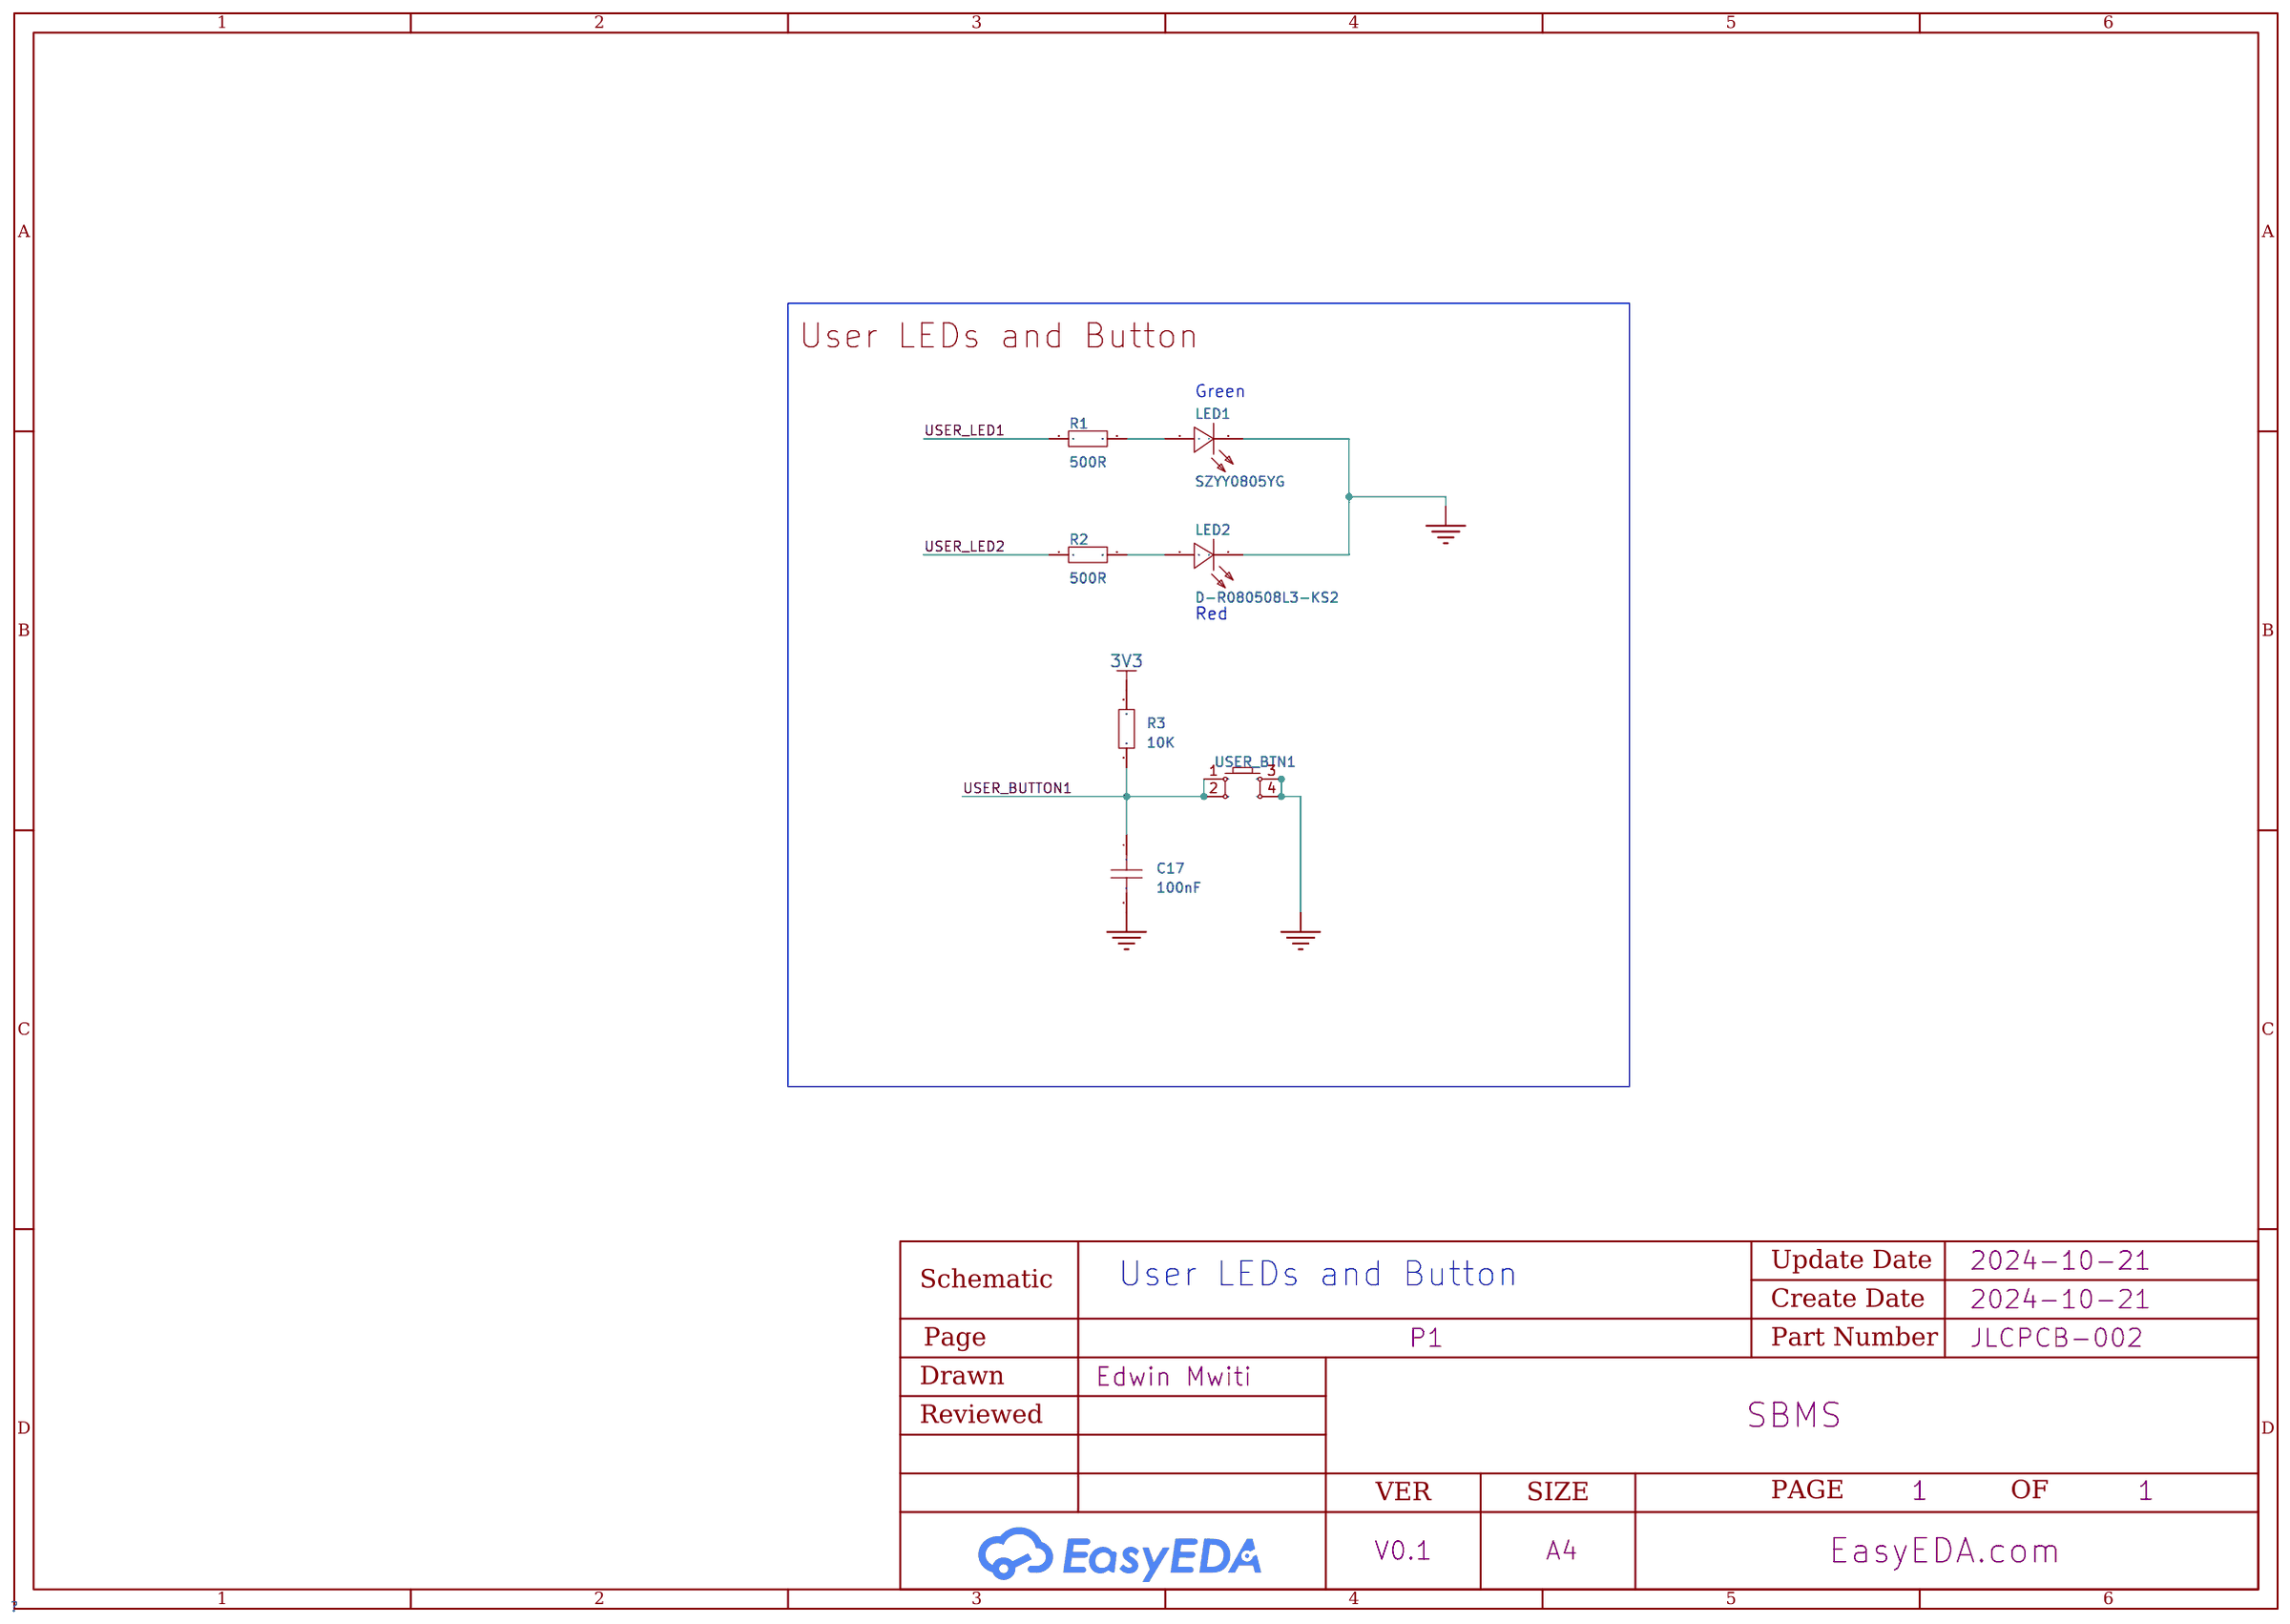
[diagram p4: schematic sheet]

## Parts
C17  100nF  [C0201]
LED1  SZYY0805YG  [LED0805-R-RD_GREEN]
LED2  D-R080508L3-KS2  [LED0805-RD]
R1  500R  [R0402]
R2  500R  [R0402]
R3  10K  [R0402]
USER_BTN1  -  [SW-SMD_4P-L6.0-W6.0-P4.50-LS9.0-2]

## Library data of the parts
C17 = CAP_0201: Supplier Footprint: 0201
LED1 = SZYY0805YG: Emitted Color:Green-yellow; LCSC Part Name: 普绿/黄绿; Supplier Part: C434435; Manufacturer: yongyu(永裕光电); Supplier Footprint: 0805; JLCPCB Part Class: Extended Part; Datasheet: https://atta.szlcsc.com/upload/public/pdf/source/20191204/C434435_1187404D4D35A500174CD35CE47973D5.pdf; Supplier: LCSC; Emitted Color: Green-yellow
LED2 = D-R080508L3-KS2: Emitted Color:Red; Supplier Part: C130114; Manufacturer: ARKLED(方舟); Supplier Footprint: 0805; JLCPCB Part Class: Extended Part; Datasheet: https://atta.szlcsc.com/upload/public/pdf/source/20170919/C130114_1505787182379976884.pdf; Supplier: LCSC; Emitted Color: Red
R1-R3 = Res_0402: Supplier Footprint: 0402
USER_BTN1 = Key_SMD_6x6x6.5: Supplier Footprint: SMD

## Nets
3V3: R3.2
GND: C17.2 LED1.2(-) LED2.1(K) USER_BTN1.3 USER_BTN1.4
USER_BUTTON1: C17.1 R3.1 USER_BTN1.1 USER_BTN1.2
USER_LED1: R1.1
USER_LED2: R2.1
Net-(LED1-1): LED1.1(+) R1.2
Net-(LED2-2): LED2.2(A) R2.2

## Notes on the sheet
- User LEDs and Button
- Green
- Red
- User LEDs and Button

# Schematic OLED_FlashMemory_1
Create Date: 2024-10-25; Page Name: P1; Project Name: SBMS; Schematic Name: OLED_FlashMemory_1; Update Date: 2024-10-25; Company: EasyEDA.com; Drawn: Edwin Mwiti; Page Size: A4; Part Number: JLCPCB-002; Reviewed: EasyEDA; Version: V0.1
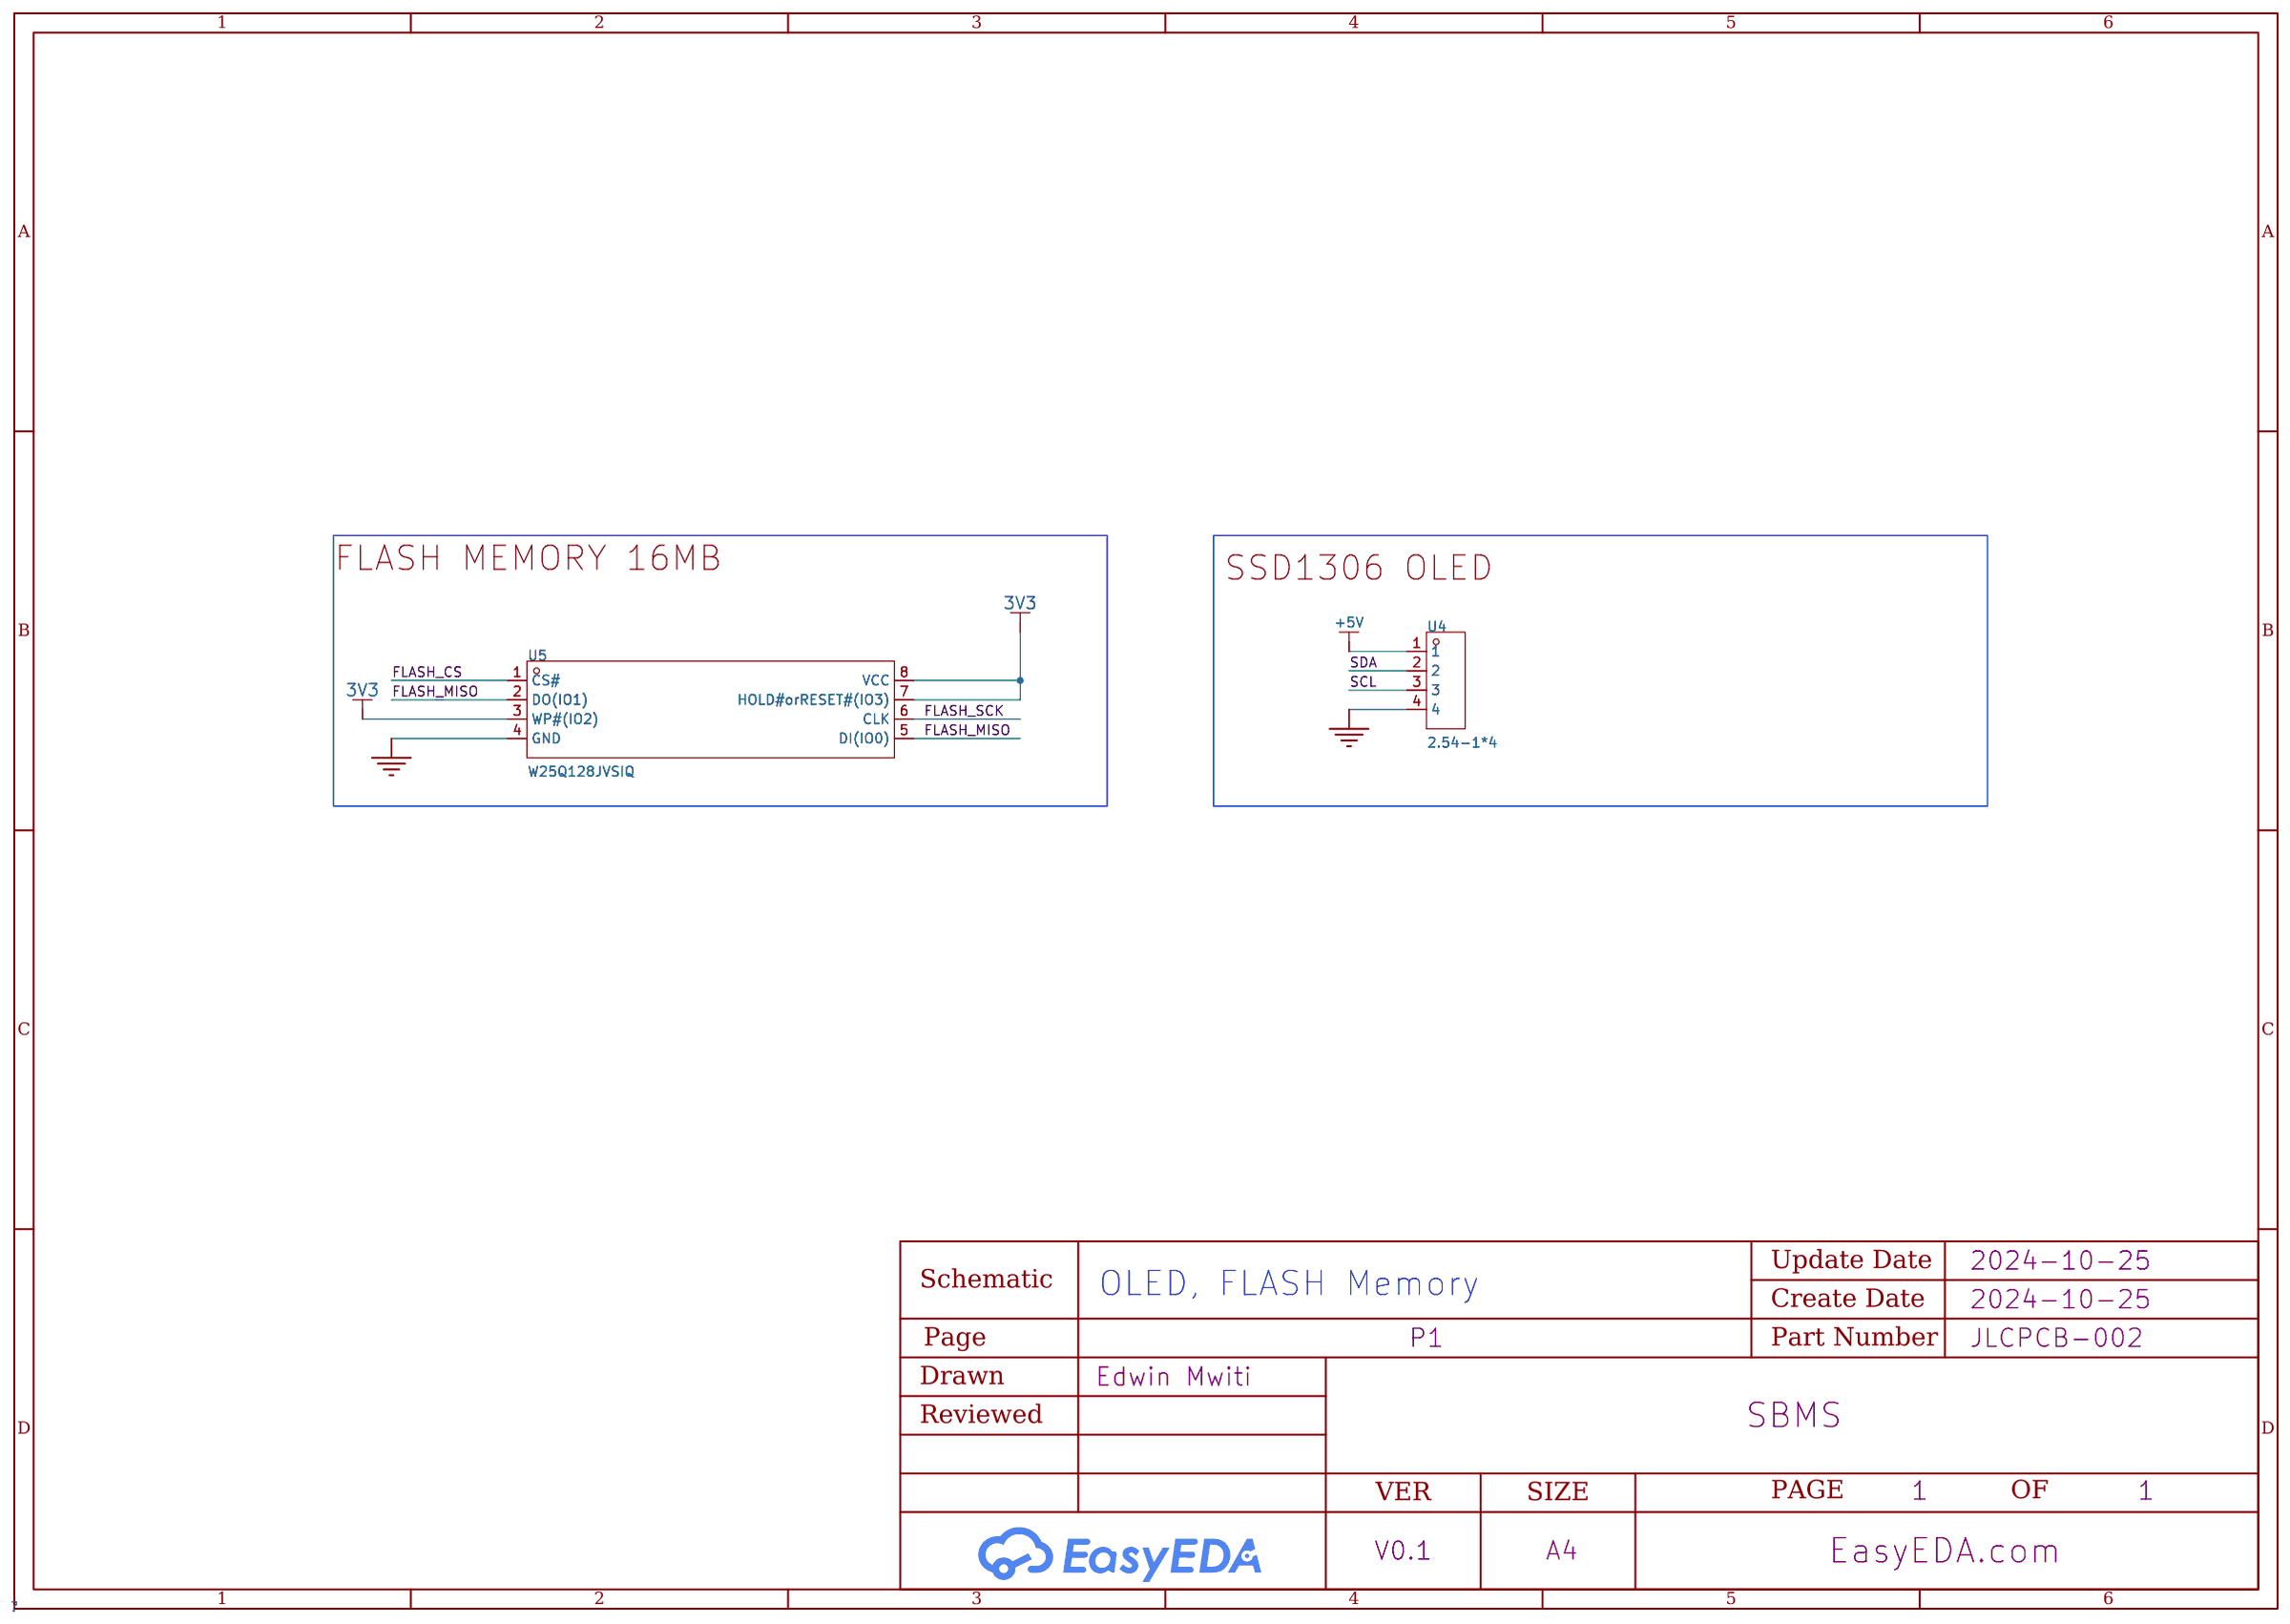
[diagram p5: schematic sheet]

## Parts
U4  2.54-1*4  [HDR-TH_4P-P2.54-V-M-1]
U5  W25Q128JVSIQ  [SOIC-8_L5.3-W5.3-P1.27-LS8.0-BL]

## Library data of the parts
U4 = 2.54-1*4: Pin Structure:1x4P Pitch:2.54mm Number of Rows:Plugin Number of Pins:4P; Supplier Part: C5116483; Manufacturer: ZHOURI(洲日); Supplier Footprint: 插件,P=2.54mm; JLCPCB Part Class: Extended Part; Datasheet: https://atta.szlcsc.com/upload/public/pdf/source/20220729/BC3442D33C9CDBB7F5DC20B12A8605A8.pdf; Supplier: LCSC; Pin Structure: 1x4P; Pitch: 2.54mm; Number of Rows: Plugin; Number of Pins: 4P
U5 = W25Q128JVSIQ_C113767: Interface Type:SPI Memory Size:128Mbit Supply Voltage:2.7V~3.6V Supply Voltage:2.7V~3.6V Page Programming Time (Tpp):3ms Operating Temperature:-40℃~+85℃ Operating Temperature:-40℃~+85℃; Supplier Part: C113767; Manufacturer: WINBOND(华邦); Supplier Footprint: SOIC-8-208mil; JLCPCB Part Class: Extended Part; Datasheet: https://atta.szlcsc.com/upload/public/pdf/source/20180329/C113767_097B64D788F6E3FFB2E9CB46CB6C1427.pdf; Supplier: LCSC; Interface Type: SPI; Memory Size: 128Mbit; Supply Voltage: 2.7V~3.6V; Page Programming Time (Tpp): 3ms; Operating Temperature: -40℃~+85℃

## Nets
3V3: U5.3(WP#(IO2)) U5.7(HOLD#orRESET#(IO3)) U5.8(VCC)
+5V: U4.1
GND: U4.4 U5.4(GND)
FLASH_CS: U5.1(CS#)
FLASH_MISO: U5.2(DO(IO1)) U5.5(DI(IO0))
FLASH_SCK: U5.6(CLK)
SCL: U4.3
SDA: U4.2

## Notes on the sheet
- FLASH MEMORY 16MB
- SSD1306 OLED
- OLED, FLASH Memory

# Board PCB6
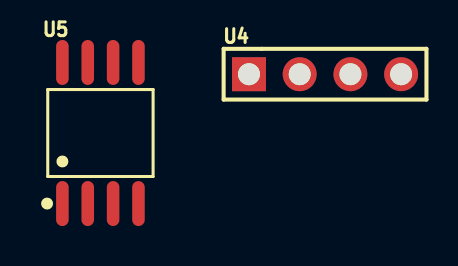
[diagram p6: board, top side]
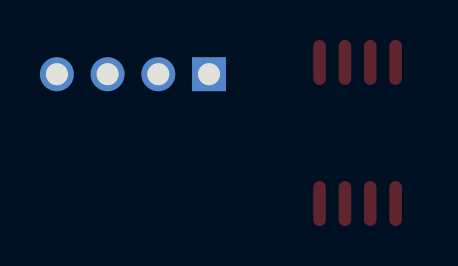
[diagram p7: board, bottom side, seen from below]

No outline. copper layers: Top Layer, Bottom Layer. Coordinates in mm from the lowest, leftmost part position.
Stack: Top Layer 0.035mm / Dielectric1 1.51mm FR4 er 4.5 / Bottom Layer 0.035mm

## Design rules (mm)
template: JLCPCB Capability(Two Layers Board)
spacing copperThickness1oz (default): track to track 0.102, other pairs 0.152 to 0.3
spacing copperThickness2oz: track to track 0.203, other pairs 0.152 to 0.3
track width copperThickness1oz (default): min 0.127, default 0.254, max 2.54
track width copperThickness2oz: min 0.203, default 0.254, max 2.54
differential pair differentialPair (default): width min 0.127, default 0.254, max 2.54; gap min 0.152, default 0.152
via viaSize (default): diameter min 0.5, default 0.61, max 10; hole min 0.3, default 0.305, max 6.3

## Placement (name value [footprint] x y rotation side)
U4  2.54-1*4  [HDR-TH_4P-P2.54-V-M-1]  11.25 2.94 0 top
U5  W25Q128JVSIQ  [SOIC-8_L5.3-W5.3-P1.27-LS8.0-BL]  0 0 0 top

## Footprints (pads in the part's own frame, mm; a bottom-side part is the same pattern mirrored in y, then rotated)
HDR-TH_4P-P2.54-V-M-1
  rect 1.7x1.7 hole 1.1: 1(-3.81,0)
  round 1.7 hole 1.1: 2(-1.27,0) 3(1.27,0) 4(3.81,0)
SOIC-8_L5.3-W5.3-P1.27-LS8.0-BL
  oval 0.63x2.25 smd: 1(-1.905,-3.53) 2(-0.635,-3.53) 3(0.635,-3.53) 4(1.905,-3.53) 5(1.905,3.53) 6(0.635,3.53) 7(-0.635,3.53) 8(-1.905,3.53)

## Nets
3V3: U5.3 U5.7 U5.8
+5V: U4.1
GND: U4.4 U5.4
FLASH_CS: U5.1
FLASH_MISO: U5.2 U5.5
FLASH_SCK: U5.6
SCL: U4.3
SDA: U4.2
